# EAGLE design pcb_power (EAGLE 9.6.2)
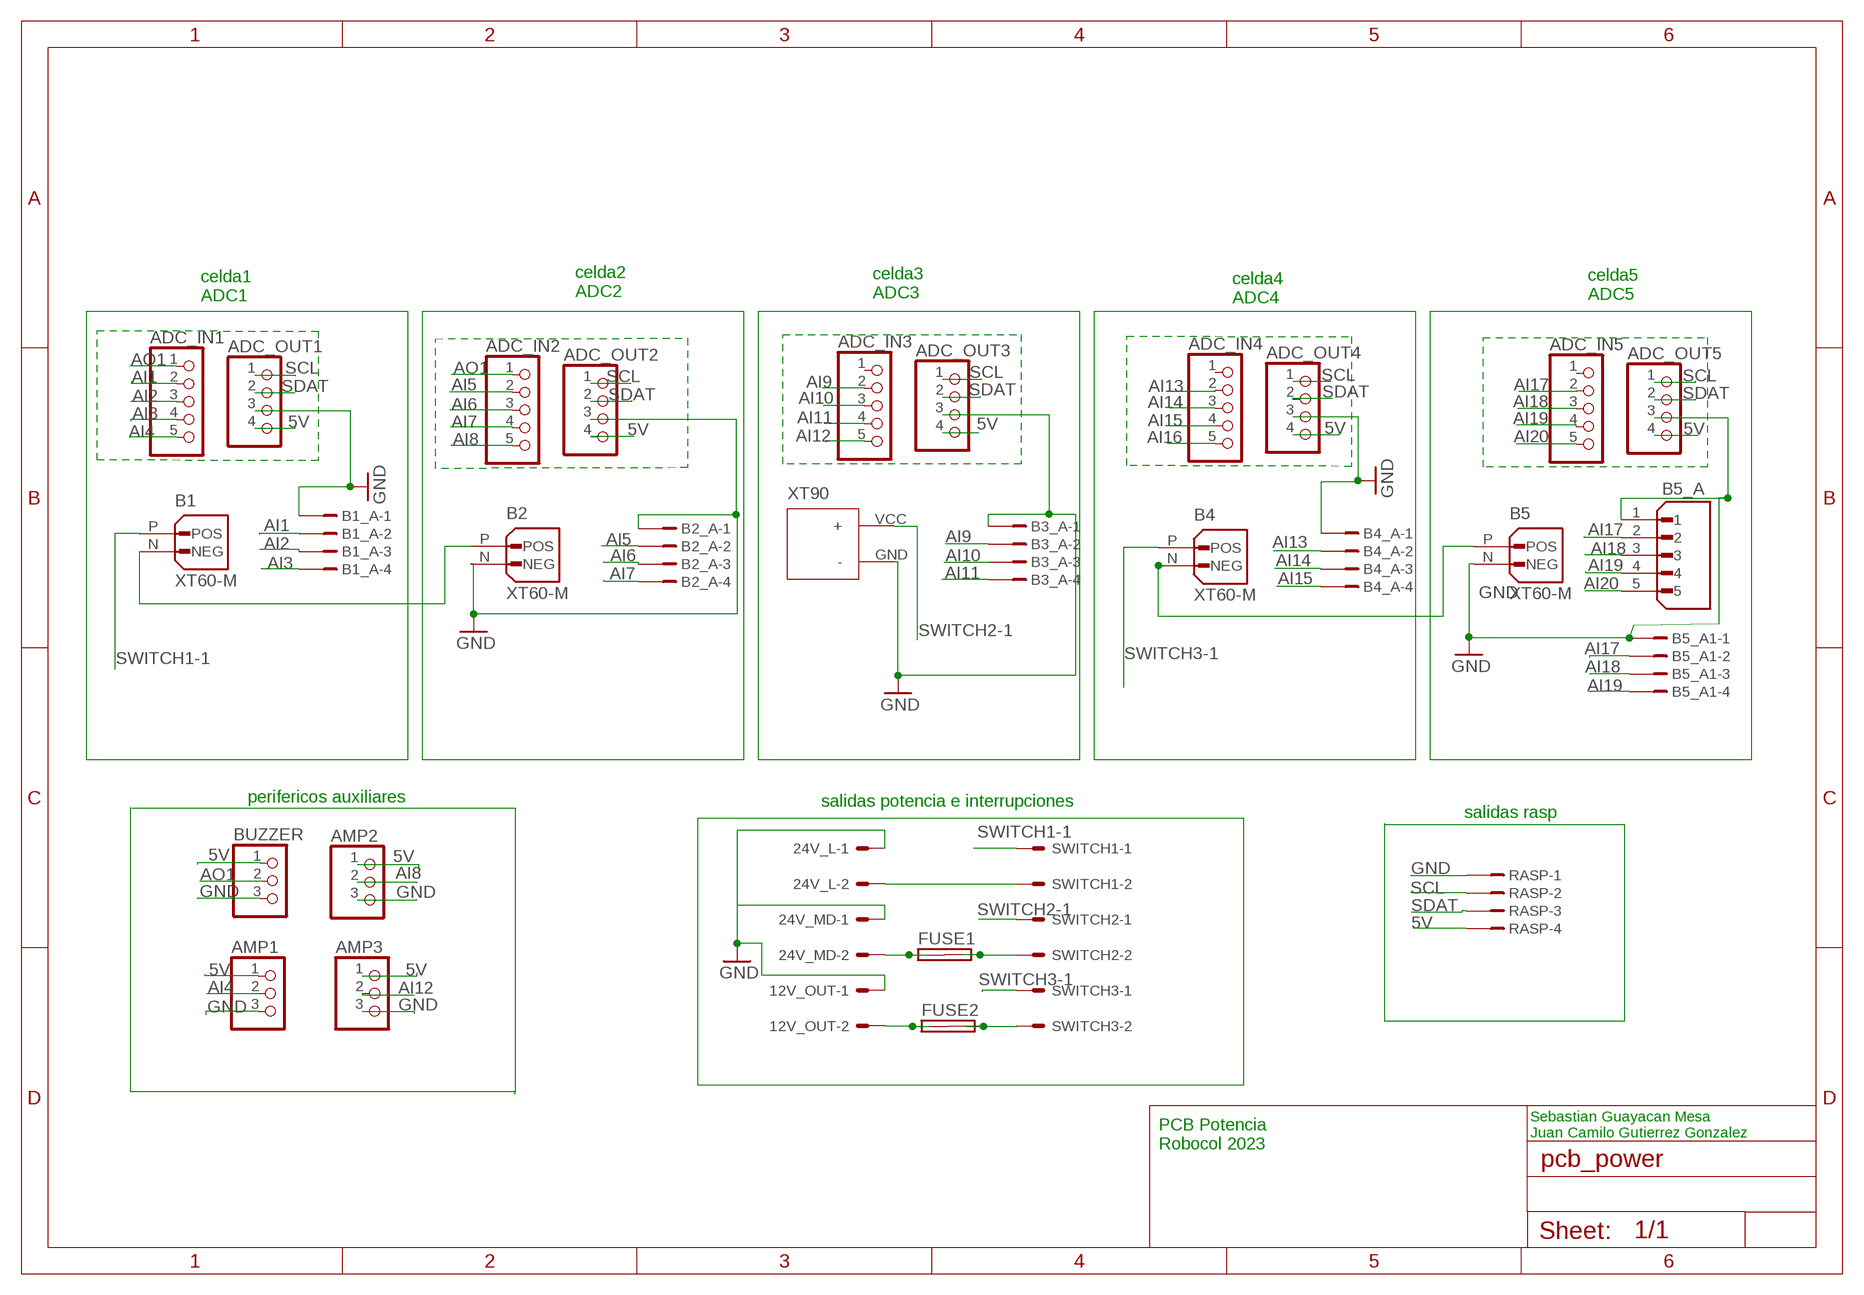
[diagram p0: schematic, sheet 1]

## Parts
12V_OUT  5566-25569-2  [5569-2]
24V_L  5566-25569-2  [5569-2]
24V_MD  5566-25569-2  [5569-2]
ADC_IN1  PINHD-1X5  [1X05]
ADC_IN2  PINHD-1X5  [1X05]
ADC_IN3  PINHD-1X5  [1X05]
ADC_IN4  PINHD-1X5  [1X05]
ADC_IN5  PINHD-1X5  [1X05]
ADC_OUT1  PINHD-1X4  [1X04]
ADC_OUT2  PINHD-1X4  [1X04]
ADC_OUT3  PINHD-1X4  [1X04]
ADC_OUT4  PINHD-1X4  [1X04]
ADC_OUT5  PINHD-1X4  [1X04]
AMP1  PINHD-1X3  [1X03]
AMP2  PINHD-1X3  [1X03]
AMP3  PINHD-1X3  [1X03]
B1  XT60-M  [AMASS_XT60-M]
B1_A  B4B-ZR  [B4B-ZR]
B2  XT60-M  [AMASS_XT60-M]
B2_A  B4B-ZR  [B4B-ZR]
B3  XT90  [XT90_PADS]
B3_A  B4B-ZR  [B4B-ZR]
B4  XT60-M  [AMASS_XT60-M]
B4_A  B4B-ZR  [B4B-ZR]
B5  XT60-M  [AMASS_XT60-M]
B5_A  B5B-ZR(LF)(SN)  [JST_B5B-ZR(LF)(SN)]
B5_A1  B4B-ZR  [B4B-ZR]
BUZZER  PINHD-1X3  [1X03]
FUSE1  SHK20L  [SHK20L]
FUSE2  SHK20L  [SHK20L]
RASP  B4B-ZR  [B4B-ZR]
SWITCH1  5566-25569-2  [5569-2]
SWITCH2  5566-25569-2  [5569-2]
SWITCH3  5566-25569-2  [5569-2]

## Nets
5V: ADC_OUT1.4 ADC_OUT2.4 ADC_OUT3.4 ADC_OUT4.4 ADC_OUT5.4 AMP1.1 AMP2.1 AMP3.1 BUZZER.1 RASP.4
AI1: ADC_IN1.2 B1_A.2
AI2: ADC_IN1.3 B1_A.3
AI3: ADC_IN1.4 B1_A.4
AI4: ADC_IN1.5 AMP1.2
AI5: ADC_IN2.2 B2_A.2
AI6: ADC_IN2.3 B2_A.3
AI7: ADC_IN2.4 B2_A.4
AI8: ADC_IN2.5 AMP2.2
AI9: ADC_IN3.2 B3_A.2
AI10: ADC_IN3.3 B3_A.3
AI11: ADC_IN3.4 B3_A.4
AI12: ADC_IN3.5 AMP3.2
AI13: ADC_IN4.2 B4_A.2
AI14: ADC_IN4.3 B4_A.3
AI15: ADC_IN4.4 B4_A.4
AI16: ADC_IN4.5
AI17: ADC_IN5.2 B5_A1.2 B5_A.2
AI18: ADC_IN5.3 B5_A1.3 B5_A.3
AI19: ADC_IN5.4 B5_A1.4 B5_A.4
AI20: ADC_IN5.5 B5_A.5
AO1: ADC_IN1.1 ADC_IN2.1 BUZZER.2
GND: 12V_OUT.1 24V_L.1 24V_MD.1 ADC_OUT1.3 ADC_OUT2.3 ADC_OUT3.3 ADC_OUT4.3 ADC_OUT5.3 AMP1.3 AMP2.3 AMP3.3 B1_A.1 B2.N(NEG) B2_A.1 B3.GND(-) B3_A.1 B4_A.1 B5.N(NEG) B5_A1.1 B5_A.1 BUZZER.3 RASP.1
N$12: 24V_MD.2 FUSE1.1A FUSE1.1B
N$13: FUSE1.2A FUSE1.2B SWITCH2.2
N$14: 12V_OUT.2 FUSE2.1A FUSE2.1B
N$15: FUSE2.2A FUSE2.2B SWITCH3.2
N$16: 24V_L.2 SWITCH1.2
N$17: B1.N(NEG) B2.P(POS)
N$20: B4.N(NEG) B5.P(POS)
SCL: ADC_OUT1.1 ADC_OUT2.1 ADC_OUT3.1 ADC_OUT4.1 ADC_OUT5.1 RASP.2
SDAT: ADC_OUT1.2 ADC_OUT2.2 ADC_OUT3.2 ADC_OUT4.2 ADC_OUT5.2 RASP.3
SWITCH1-1: B1.P(POS) SWITCH1.1
SWITCH2-1: B3.VCC(+) SWITCH2.1
SWITCH3-1: B4.P(POS) SWITCH3.1
Unconnected: ADC_IN3.1 ADC_IN4.1 ADC_IN5.1

## Notes on the sheet
- celda2
  ADC2
- celda3
  ADC3
- celda5
  ADC5
- celda1
  ADC1
- celda4
  ADC4
- perifericos auxiliares | salidas potencia e interrupciones
- salidas rasp
- Sebastian Guayacan Mesa
  Juan Camilo Gutierrez Gonzalez
- PCB Potencia
  Robocol 2023

## Library data of the parts
12V_OUT 24V_L 24V_MD SWITCH1-SWITCH3 = molex_arreglado_2:5566-2: Mini FIT connector 2 pol Source: http://www.molex.com
ADC_IN1-ADC_IN5 = pinhead:PINHD-1X5: PIN HEADER
ADC_OUT1-ADC_OUT5 = pinhead:PINHD-1X4: PIN HEADER
AMP1-AMP3 BUZZER = pinhead:PINHD-1X3: PIN HEADER
B1 B2 B4 B5 = XT60-M:XT60-M: Check availability <https://pricing.snapeda.com/parts/XT60-M/AMASS/view-part?ref=eda>; AVAILABILITY: Not in stock; DESCRIPTION: Plug; DC supply; XT60; male; PIN: 2; for cable; soldered; 30A; 500V; MF: AMASS; MP: XT60-M; PACKAGE: Package; PRICE: None
B1_A B2_A B3_A B4_A B5_A1 RASP = con-jst:?4B-ZR: ZH CONNECTOR 1.5 mm, 4 pin 1 row Source: http://www.jst.com .. eZH.pdf; MF: FARNELL; MPN: B4B-ZR(LF)(SN); OC_FARNELL: 1830916; OC_NEWARK: 37K9960
B3 = Robocol_Eagle_Libraries:XT90: XT90 Reference: XT-90 Type: Male Connector. Description: Special connector for Lipo Batteries. Author: Franz Luepke. Year: 2020 Made for use in: Robocol Uniandes.
B5_A = B5B-ZR_LF__SN_:B5B-ZR(LF)(SN): Check availability <https://pricing.snapeda.com/parts/B5B-ZR%20%28LF%29%28SN%29/JST/view-part?ref=eda>; AVAILABILITY: In Stock; DESCRIPTION: Conn Shrouded Header HDR 5 POS 1.5mm Solder ST Thru-Hole Box; MF: JST; MP: B5B-ZR (LF)(SN); PACKAGE: None; PRICE: None; PURCHASE-URL: https://pricing.snapeda.com/search/part/B5B-ZR (LF)(SN)/?ref=eda
FUSE1 FUSE2 = fuse:SHK20L: FUSE HOLDER 5 x 20 mm, SH contact, SHH1 Schukat, E1073 Buerklin; OC_FARNELL: unknown; OC_NEWARK: unknown

## Board
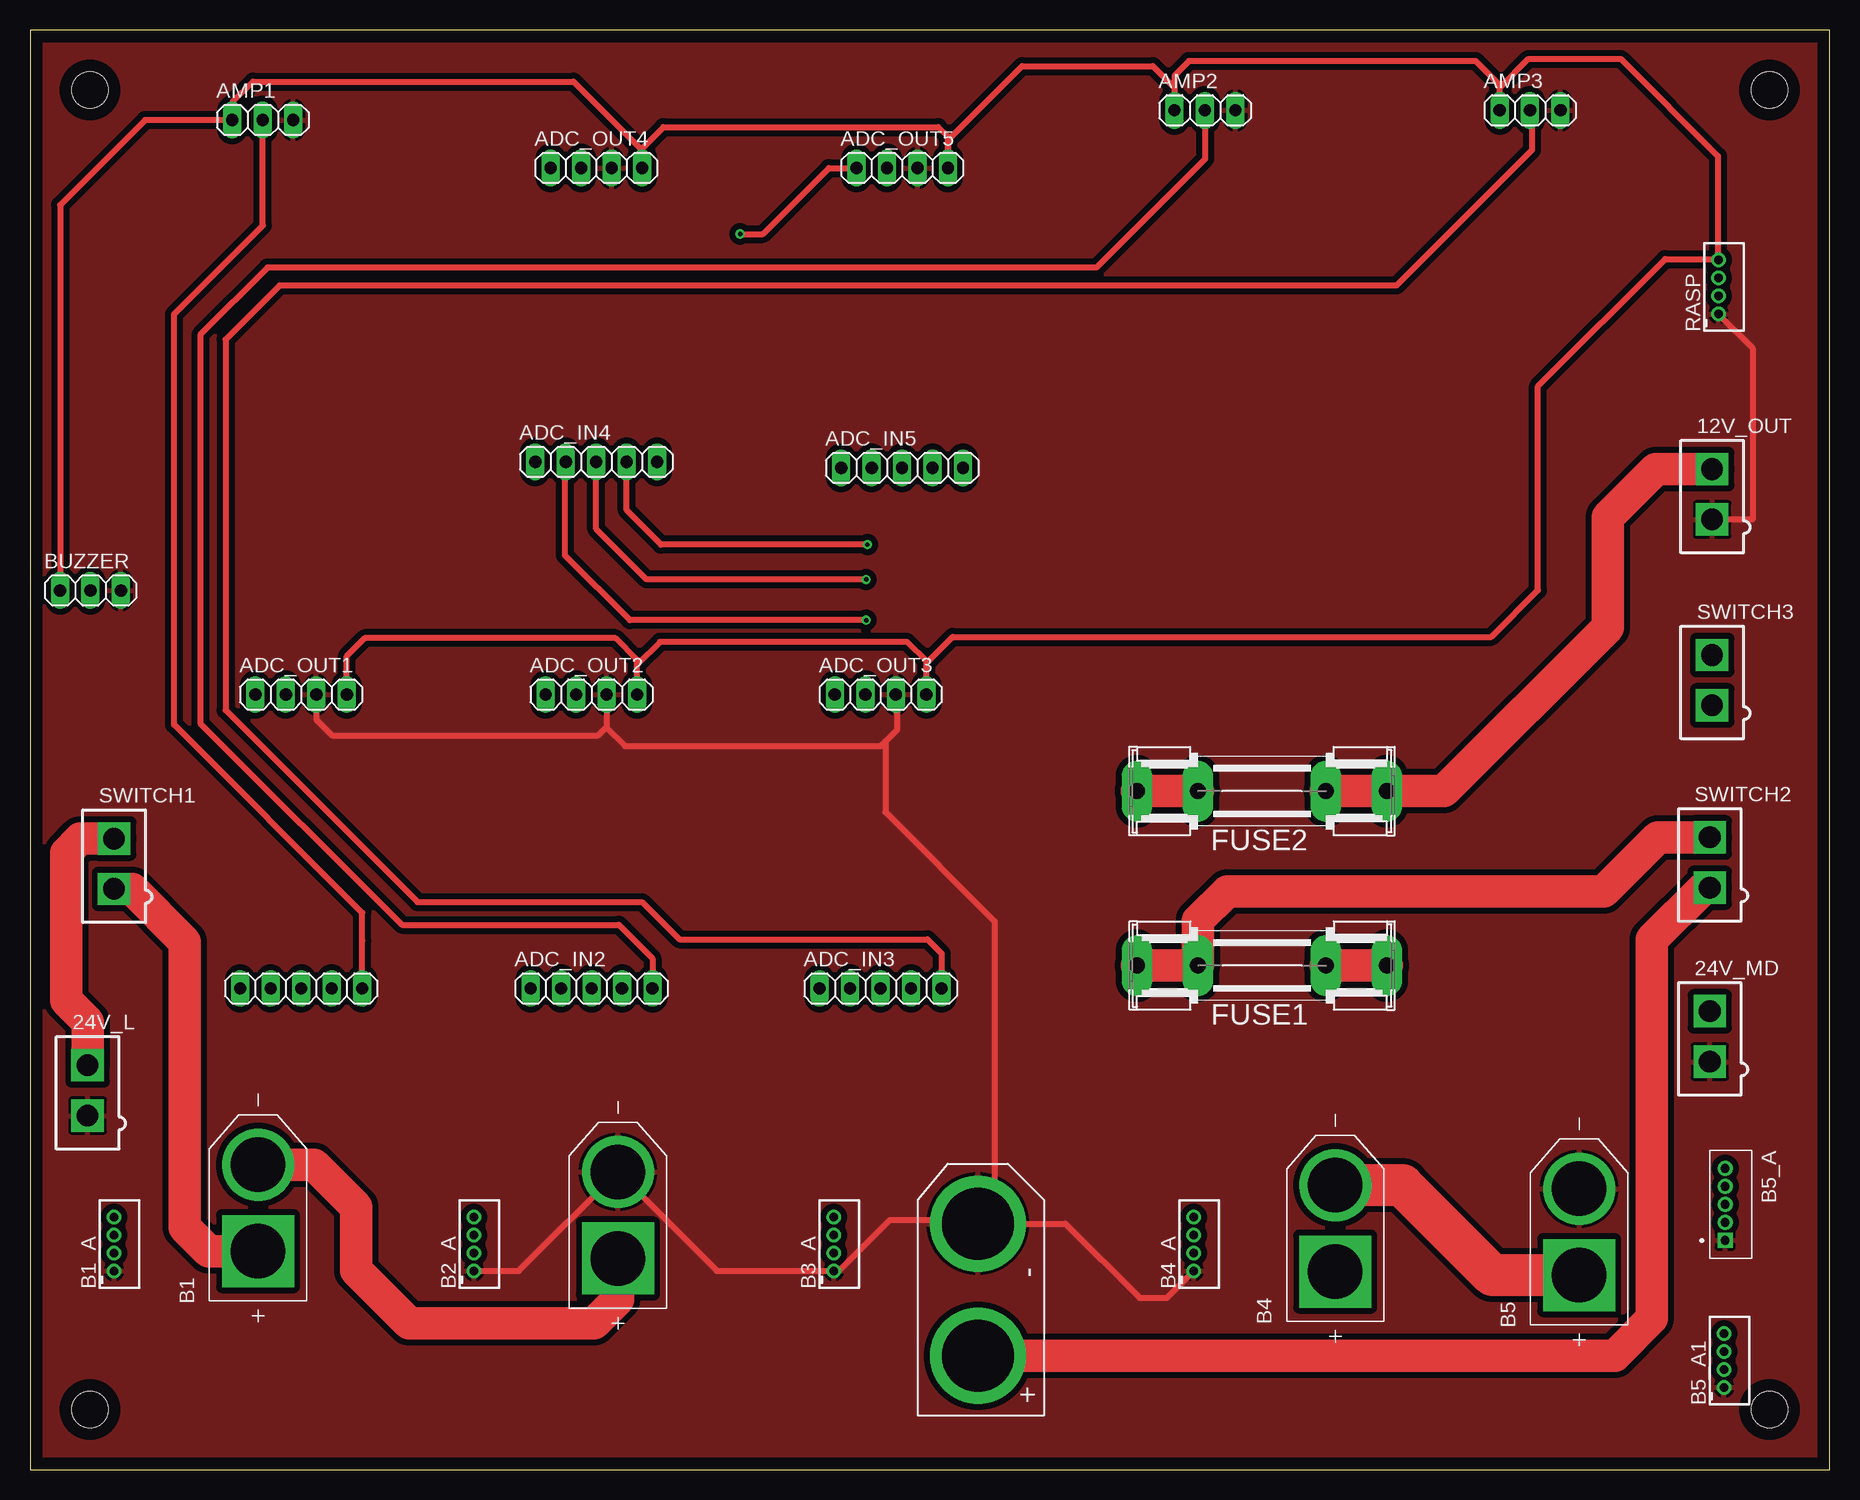
[diagram p1: board, top side]
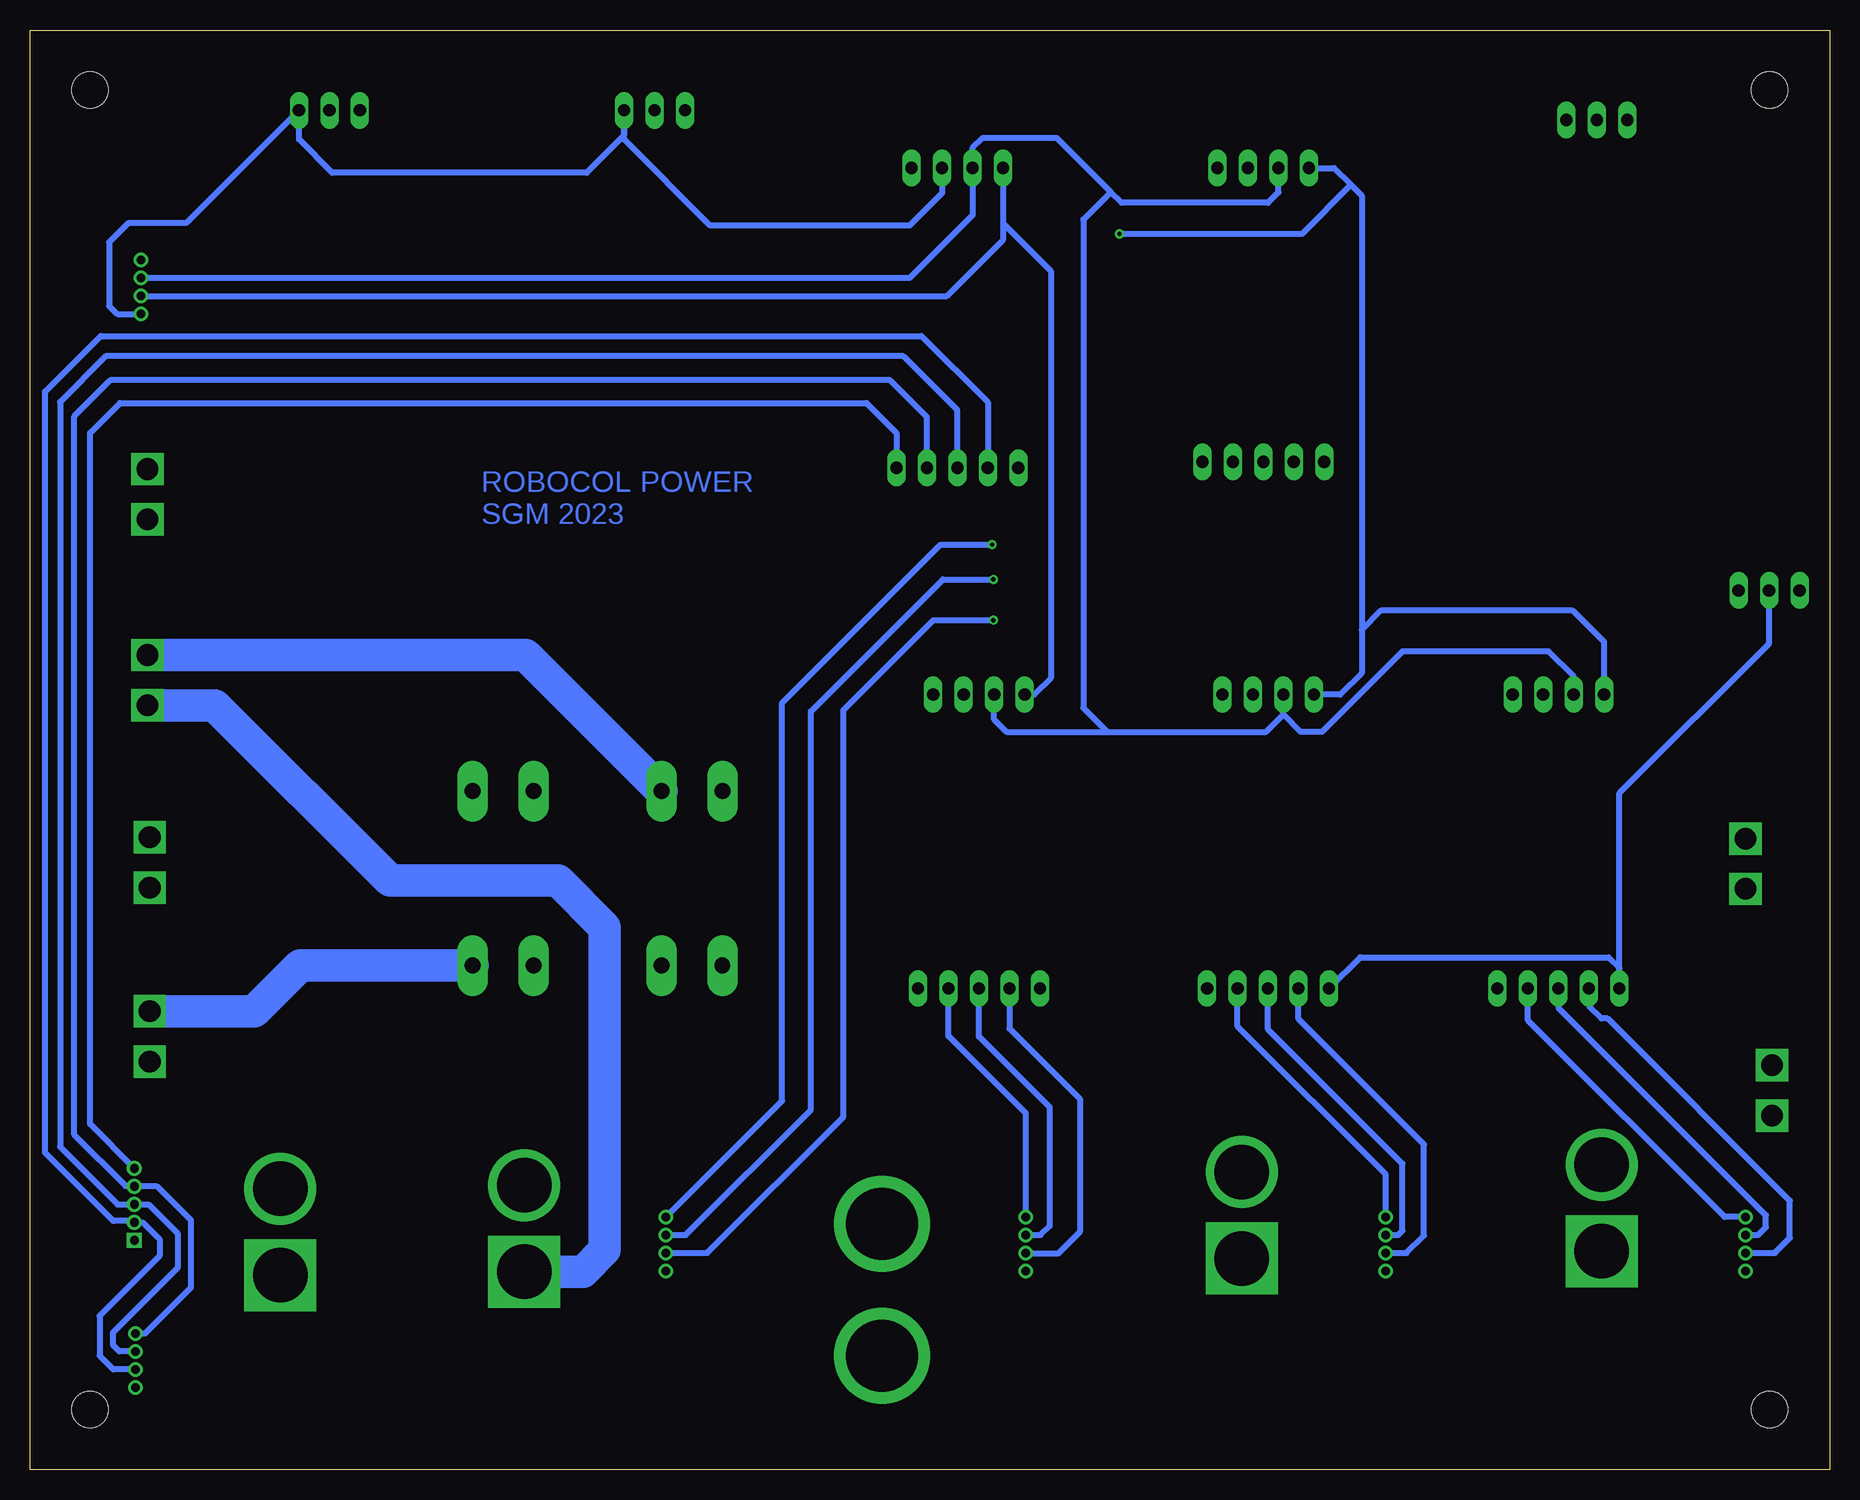
[diagram p2: board, bottom side, seen from below]

Size 150 x 120 mm. Coordinates in mm from the lower left corner, seen from the top.
Outline: 0,0 150,0 150,120 0,120 0,0
Copper layers (1*16): Top 0.035mm / dielectric 1.5mm / Bottom 0.035mm
Design rules "default *": minimum track width 6mil, minimum drill 0.35mm, track to track 0.5mm, track to pad 0.5mm, pad to pad 0.5mm, via to via 0.5mm, smd to smd 0.5mm, copper to edge 40mil, drill to drill 0.5mm, minimum pad ring 10mil, minimum via ring 8mil, stop-mask expansion 4mil, vias tented up to drill 0mil, thermal gap 10mil
Holes 3 mm at 5,115 145,115 5,5 145,5

### Footprints (pad centres in the part's own frame; a part is rotated, then mirrored left to right if it is on the bottom)
5569-2 = drill 1.8 square: 1 0,-2.1; 2 0,2.1
1X05 = drill 1.016 long: 1 -5.08,0; 2 -2.54,0; 3 0,0; 4 2.54,0; 5 5.08,0
1X04 = drill 1.016 long: 1 -3.81,0; 2 -1.27,0; 3 1.27,0; 4 3.81,0
1X03 = drill 1.016 long: 1 -2.54,0; 2 0,0; 3 2.54,0
AMASS_XT60-M = drill 4.55 pad 6: N 3.6,0 | drill 4.55 pad 6 square: P -3.6,0
B4B-ZR = drill 0.7 pad 1.1: 1 -2.25,0; 2 -0.75,0; 3 0.75,0; 4 2.25,0
XT90_PADS = drill 6 pad 8: GND 5.5,0; VCC -5.5,0
JST_B5B-ZR(LF)(SN) = drill 0.73 square: 1 0,0 | drill 0.73: 2 -1.5,0; 3 -3,0; 4 -4.5,0; 5 -6,0
SHK20L = drill 1.321 pad 2.54 long: 1A -10.414,0; 1B -5.334,0; 2A 10.414,0; 2B 5.334,0

### Placement (x,y rotation side)
12V_OUT  140.22,81.3 0 top
24V_L  4.8,31.6 0 top
24V_MD  140.02,36.1 0 top
ADC_IN1  22.6,40.1 0 top
ADC_IN2  46.8,40.1 0 top
ADC_IN3  70.9,40.1 0 top
ADC_IN4  47.2,84 0 top
ADC_IN5  72.7,83.5 0 top
ADC_OUT1  22.6,64.6 0 top
ADC_OUT2  46.8,64.6 0 top
ADC_OUT3  70.9,64.6 0 top
ADC_OUT4  47.2,108.5 0 top
ADC_OUT5  72.7,108.5 0 top
AMP1  19.41,112.5 0 top
AMP2  97.94,113.3 0 top
AMP3  125.04,113.3 0 top
B1  19,21.8 90 top
B1_A  7,18.8 90 top
B2  49,21.2 90 top
B2_A  37,18.8 90 top
B3  79,15 90 top
B3_A  67,18.8 90 top
B4  108.8,20.1 90 top
B4_A  97,18.8 90 top
B5  129.13,19.8 90 top
B5_A  141.3,19.1 270 top
B5_A1  141.2,9.1 90 top
BUZZER  5.04,73.28 0 top
FUSE1  102.7,42.01 180 top
FUSE2  102.69,56.55 180 top
RASP  140.75,98.57 90 top
SWITCH1  7,50.5 0 top
SWITCH2  140.02,50.6 0 top
SWITCH3  140.22,65.8 0 top

### Tracks (layer width: path | path; a pad name or v marks a point on that pad's centre or on a via)
5V
  Top 0.508: 95.4,115.2 AMP2.1 | 95.4,115.2 93.6,117 82.7,117 76.51,110.81 ADC_OUT5.4 76.51,111.09 75.7,111.9 52.8,111.9 51.01,110.11 ADC_OUT4.4 51.01,109.99 45.3,115.7 18.6,115.7 16.86,113.97 AMP1.1 9.6,112.5 2.5,105.4 BUZZER.1 | 95.4,115.2 95.4,116.2 96.6,117.4 120.5,117.4 122.5,115.4 AMP3.1 122.5,115.2 124.9,117.6 132.6,117.6 140.7,109.5 140.7,100.86 RASP.4 140.66,100.9 136.3,100.9 125.7,90.3 125.7,73.3 121.8,69.4 76.9,69.4 74.89,67.39 74.71,67.39 | ADC_OUT3.4 74.71,67.39 | 50.61,67.11 52.5,69 73.1,69 74.71,67.39 | ADC_OUT2.4 50.61,67.11 | 50.61,67.11 50.61,67.49 48.8,69.3 27.9,69.3 26.41,67.81 ADC_OUT1.4
AI1
  Bottom 0.508: B1_A.2 4.55,18.05 3.3,19.3 3.3,22.4 18.5,37.6 19,37.6 20.06,38.66 ADC_IN1.2
AI2
  Bottom 0.508: B1_A.3 5.95,19.55 5.3,20.2 5.3,21.2 22.6,38.5 ADC_IN1.3
AI3
  Bottom 0.508: B1_A.4 8.75,21.05 25.14,37.44 ADC_IN1.4
AI4
  Top 0.508: ADC_IN1.5 27.68,44.08 27.7,44.1 27.7,46.4 12,62.1 12,96.3 19.41,103.7 AMP1.2
AI5
  Bottom 0.508: B2_A.2 35.25,18.05 33.8,19.5 33.8,27.1 44.26,37.56 ADC_IN2.2
AI6
  Bottom 0.508: B2_A.3 35.95,19.55 35.6,19.9 35.6,25.5 46.8,36.7 ADC_IN2.3
AI7
  Bottom 0.508: B2_A.4 37,24.6 49.34,36.94 ADC_IN2.4
AI8
  Top 0.508: AMP2.2 97.94,109.24 88.9,100.2 19.8,100.2 14.2,94.6 14.2,62.2 31,45.4 49.1,45.4 51.88,42.62 ADC_IN2.5
AI9
  Bottom 0.508: ADC_IN3.2 68.36,36.76 62.5,30.9 62.5,19.8 64.3,18 66.95,18 B3_A.2
AI10
  Bottom 0.508: B3_A.3 65.75,19.55 65,20.3 65,30.2 70.9,36.1 ADC_IN3.3
AI11
  Bottom 0.508: B3_A.4 67,29.7 73.44,36.14 ADC_IN3.4
AI12
  Top 0.508: AMP3.2 125.2,113.14 125.2,110 113.9,98.7 20.8,98.7 16.3,94.2 16.3,63.3 32.29,47.31 51.02,47.31 54.13,44.2 74.8,44.2 75.98,43.02 ADC_IN3.5
AI13  (via drill 0.35)
  Top 0.508: v69.7,70.8 50,70.8 44.6,76.2 44.6,83.94 ADC_IN4.2
  Bottom 0.508: B4_A.2 93.55,18.05 82.2,29.4 82.2,63.3 74.7,70.8 v69.7,70.8
AI14  (via drill 0.35)
  Top 0.508: v69.7,74.2 51.4,74.2 47.2,78.4 ADC_IN4.3
  Bottom 0.508: B4_A.3 95.35,19.55 84.9,30 84.9,63.2 73.9,74.2 v69.7,74.2
AI15  (via drill 0.35)
  Top 0.508: v69.8,77.1 52.6,77.1 49.74,79.96 ADC_IN4.4
  Bottom 0.508: B4_A.4 87.3,30.75 87.3,63.9 74.1,77.1 v69.8,77.1
AI17
  Bottom 0.508: B5_A1.2 143.05,8.35 144.2,9.5 144.2,12.8 139.2,17.8 139.2,19.2 140.6,20.6 B5_A.2 141.43,20.73 143.05,20.73 148.73,26.4 148.73,89.87 144.1,94.5 75.7,94.5 70.16,88.96 ADC_IN5.2
AI18
  Bottom 0.508: B5_A1.3 142.55,9.85 143.1,10.4 143.1,11.4 137.71,16.79 137.71,19.7 140.11,22.1 B5_A.3 142.7,22.1 147.5,26.9 147.5,89 143.7,92.8 77.2,92.8 72.7,88.3 ADC_IN5.3
AI19
  Bottom 0.508: B5_A1.4 140.4,11.35 136.6,15.15 136.6,20.8 139.4,23.6 B5_A.4 141.33,23.63 142.03,23.63 146.3,27.9 146.3,87.8 143.3,90.8 78.3,90.8 75.24,87.74 ADC_IN5.4
AI20
  Bottom 0.508: B5_A.5 145,28.8 145,86.4 142.5,88.9 80.28,88.9 77.78,86.4 ADC_IN5.5
AO1
  Bottom 0.508: ADC_IN1.1 17.52,41.8 | 17.52,41.8 17.52,56.38 5.04,68.86 BUZZER.2 | ADC_IN2.1 39.12,42.7 18.42,42.7 17.52,41.8
GND
  Top 0.508: ADC_OUT2.3 48.07,61.9 | 48.07,61.9 48.07,61.83 49.6,60.3 70.9,60.3 71.3,60.7 | 71.3,60.7 72.3,61.7 72.3,64.47 ADC_OUT3.3 | ADC_OUT1.3 23.87,62.53 25.2,61.2 47.37,61.2 48.07,61.9 | 71.3,60.7 71.3,54.8 80.4,45.7 80.4,21.9 79.3,20.8 | 79.3,20.8 B3.GND 86.3,20.5 92.5,14.3 94.75,14.3 B4_A.1 | 79.3,20.8 71.67,20.8 67.56,16.69 67.14,16.69 B3_A.1 57.25,16.55 B2.N 40.75,16.55 B2_A.1 | RASP.1 143.6,93.47 143.6,79.2 12V_OUT.1
  Bottom 0.508: ADC_OUT5.3 73.97,106.4 76.67,103.7 93.3,103.7 100.48,110.88 AMP2.3 100.48,111.22 103.6,108.1 124.8,108.1 127.58,110.88 AMP3.3 136.98,103.9 141.8,103.9 143.4,102.3 143.4,97 142.72,96.32 RASP.1
  pour Top: 149.4,0.5 149.4,119.6 0.5,119.6 0.5,0.5
N$12
  Top 2.7: FUSE1.1B FUSE1.1A
  Bottom 2.7: FUSE1.1A 127.49,42.01 131.3,38.2 24V_MD.2
N$13
  Top 2.7: FUSE1.2A FUSE1.2B 97.37,45.77 99.8,48.2 131.2,48.2 135.7,52.7 SWITCH2.2
N$14
  Top 2.7: FUSE2.1B FUSE2.1A 117.85,56.55 131.5,70.2 131.5,79.4 135.5,83.4 12V_OUT.2
N$15
  Top 2.7: FUSE2.2A FUSE2.2B
  Bottom 2.7: FUSE2.2B 108.71,67.9 SWITCH3.2
N$16
  Top 2.7: SWITCH1.2 4.2,52.6 3,51.4 3,39.1 4.8,37.3 24V_L.2
N$17
  Top 2.7: B1.N 23.7,25.4 27.2,21.9 27.2,16.6 31.6,12.2 47,12.2 49,14.2 B2.P
N$20
  Top 3.5: B4.N 114.4,23.7 121.9,16.2 B5.P
SCL  (via drill 0.35)
  Top 0.508: v59.2,103 61.1,103 66.6,108.5 ADC_OUT5.1
  Bottom 0.508: ADC_OUT4.1 41.3,108.5 39.9,107.1 | 39.9,107.1 39,106.2 39,70 | 39,70 39,66.4 40.8,64.6 ADC_OUT2.1 | ADC_OUT3.1 66.3,64.6 64.9,66 64.9,99.91 68.89,103.9 ADC_OUT5.1 68.9,102.5 73.58,97.82 RASP.2 | ADC_OUT1.1 18.79,68.99 21.4,71.6 37.4,71.6 39,70 | 39.9,107.1 44,103 v59.2,103
SDAT
  Bottom 0.508: 45.53,62.93 44.1,61.5 42.3,61.5 35.6,68.2 23.4,68.2 21.33,66.13 ADC_OUT1.2 | 60.2,61.5 68.6,61.5 69.63,62.53 ADC_OUT3.2 | 60.2,61.5 46.96,61.5 45.53,62.93 | 59.9,106.5 59,105.6 46.8,105.6 45.93,106.47 ADC_OUT4.2 | 59.9,106.5 64.4,111 70.6,111 71.43,110.17 ADC_OUT5.2 71.43,104.57 76.68,99.32 RASP.3 | 59.9,106.5 62.2,104.2 62.2,63.5 60.2,61.5 | 45.53,62.93 ADC_OUT2.2
SWITCH1-1
  Top 2.7: SWITCH1.1 8.5,48.4 12.9,44 12.9,20.2 14.9,18.2 B1.P
SWITCH2-1
  Top 2.7: B3.VCC 132.1,9.5 135.2,12.6 135.2,44.2 139.5,48.5 SWITCH2.1
SWITCH3-1
  Bottom 2.7: B4.P 103.9,16.5 102.1,18.3 102.1,45.2 106,49.1 120,49.1 134.6,63.7 SWITCH3.1

### Text on the board
Bottom: ROBOCOL POWER / SGM 2023